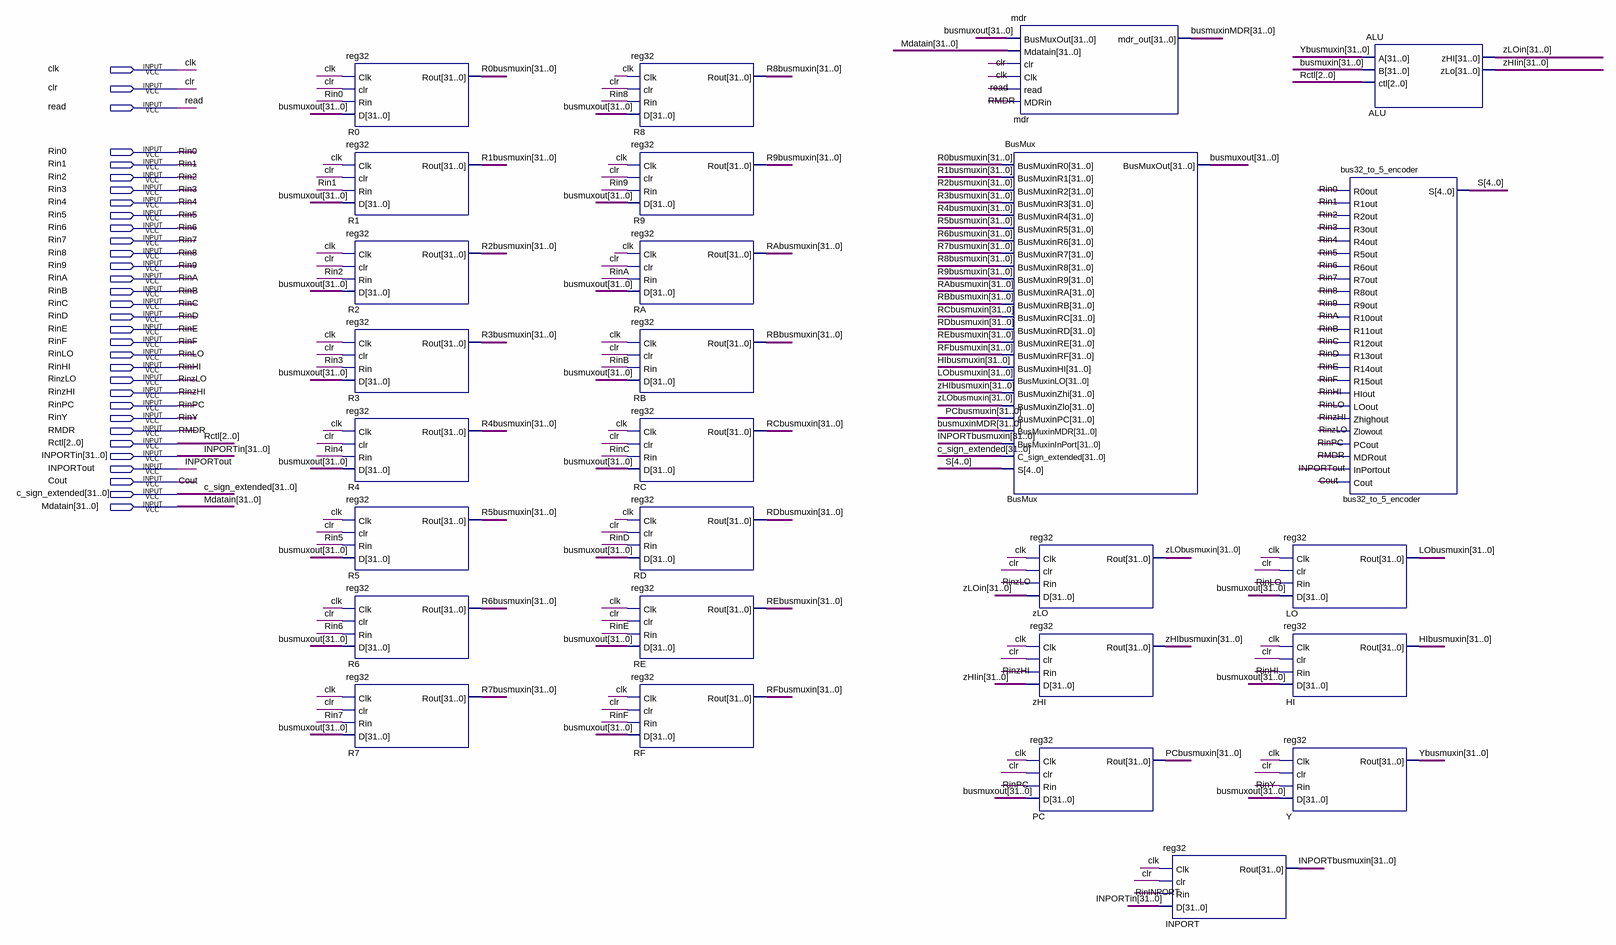
[diagram p0: schematic sheet]
// Quartus schematic Phase1.bdf as structural Verilog: 27 symbols, 32 pins
module Phase1 (
  input  clk,
  input  clr,
  input  read,
  input  Rin0,
  input  Rin1,
  input  Rin2,
  input  Rin3,
  input  Rin4,
  input  Rin5,
  input  Rin6,
  input  Rin7,
  input  Rin8,
  input  Rin9,
  input  RinA,
  input  RinB,
  input  RinC,
  input  RinD,
  input  RinE,
  input  RinF,
  input  RinLO,
  input  RinHI,
  input  RinzLO,
  input  RinzHI,
  input  RinPC,
  input  RinY,
  input  RMDR,
  input  [2:0] Rctl,
  input  [31:0] INPORTin,
  input  INPORTout,
  input  Cout,
  input  [31:0] c_sign_extended,
  input  [31:0] Mdatain
);

  wire RinINPORT;
  wire [4:0] S;
  wire [31:0] busmuxin, busmuxinMDR, busmuxout, HIbusmuxin, INPORTbusmuxin, LObusmuxin, PCbusmuxin,
       R0busmuxin, R1busmuxin, R2busmuxin, R3busmuxin, R4busmuxin, R5busmuxin, R6busmuxin, R7busmuxin,
       R8busmuxin, R9busmuxin, RAbusmuxin, RBbusmuxin, RCbusmuxin, RDbusmuxin, REbusmuxin, RFbusmuxin,
       Ybusmuxin, zHIbusmuxin, zHIin, zLObusmuxin, zLOin;

  reg32 R0 (.Clk(clk), .clr(clr), .Rin(Rin0), .D(busmuxout), .Rout(R0busmuxin));
  reg32 R1 (.Clk(clk), .clr(clr), .Rin(Rin1), .D(busmuxout), .Rout(R1busmuxin));
  reg32 R2 (.Clk(clk), .clr(clr), .Rin(Rin2), .D(busmuxout), .Rout(R2busmuxin));
  reg32 R3 (.Clk(clk), .clr(clr), .Rin(Rin3), .D(busmuxout), .Rout(R3busmuxin));
  reg32 R4 (.Clk(clk), .clr(clr), .Rin(Rin4), .D(busmuxout), .Rout(R4busmuxin));
  reg32 R5 (.Clk(clk), .clr(clr), .Rin(Rin5), .D(busmuxout), .Rout(R5busmuxin));
  reg32 R6 (.Clk(clk), .clr(clr), .Rin(Rin6), .D(busmuxout), .Rout(R6busmuxin));
  reg32 R7 (.Clk(clk), .clr(clr), .Rin(Rin7), .D(busmuxout), .Rout(R7busmuxin));
  reg32 R8 (.Clk(clk), .clr(clr), .Rin(Rin8), .D(busmuxout), .Rout(R8busmuxin));
  reg32 R9 (.Clk(clk), .clr(clr), .Rin(Rin9), .D(busmuxout), .Rout(R9busmuxin));
  reg32 RA (.Clk(clk), .clr(clr), .Rin(RinA), .D(busmuxout), .Rout(RAbusmuxin));
  reg32 RB (.Clk(clk), .clr(clr), .Rin(RinB), .D(busmuxout), .Rout(RBbusmuxin));
  reg32 RC (.Clk(clk), .clr(clr), .Rin(RinC), .D(busmuxout), .Rout(RCbusmuxin));
  reg32 RD (.Clk(clk), .clr(clr), .Rin(RinD), .D(busmuxout), .Rout(RDbusmuxin));
  reg32 RE (.Clk(clk), .clr(clr), .Rin(RinE), .D(busmuxout), .Rout(REbusmuxin));
  reg32 RF (.Clk(clk), .clr(clr), .Rin(RinF), .D(busmuxout), .Rout(RFbusmuxin));
  mdr mdr (
    .BusMuxOut(busmuxout), .Mdatain(Mdatain), .clr(clr), .Clk(clk), .read(read), .MDRin(RMDR),
    .mdr_out(busmuxinMDR));
  BusMux BusMux (
    .BusMuxinR0(R0busmuxin), .BusMuxinR1(R1busmuxin), .BusMuxinR2(R2busmuxin), .BusMuxinR3(R3busmuxin),
    .BusMuxinR4(R4busmuxin), .BusMuxinR5(R5busmuxin), .BusMuxinR6(R6busmuxin), .BusMuxinR7(R7busmuxin),
    .BusMuxinR8(R8busmuxin), .BusMuxinR9(R9busmuxin), .BusMuxinHI(HIbusmuxin), .BusMuxinLO(LObusmuxin),
    .BusMuxinZhi(zHIbusmuxin), .BusMuxinZlo(zLObusmuxin), .BusMuxinPC(PCbusmuxin), .BusMuxinMDR(busmuxinMDR),
    .BusMuxinInPort(INPORTbusmuxin), .C_sign_extended(c_sign_extended), .S(S), .BusMuxinRA(RAbusmuxin),
    .BusMuxinRB(RBbusmuxin), .BusMuxinRC(RCbusmuxin), .BusMuxinRD(RDbusmuxin), .BusMuxinRE(REbusmuxin),
    .BusMuxinRF(RFbusmuxin), .BusMuxOut(busmuxout));
  reg32 zLO (.Clk(clk), .clr(clr), .Rin(RinzLO), .D(zLOin), .Rout(zLObusmuxin));
  reg32 zHI (.Clk(clk), .clr(clr), .Rin(RinzHI), .D(zHIin), .Rout(zHIbusmuxin));
  reg32 PC (.Clk(clk), .clr(clr), .Rin(RinPC), .D(busmuxout), .Rout(PCbusmuxin));
  reg32 INPORT (.Clk(clk), .clr(clr), .Rin(RinINPORT), .D(INPORTin), .Rout(INPORTbusmuxin));
  reg32 LO (.Clk(clk), .clr(clr), .Rin(RinLO), .D(busmuxout), .Rout(LObusmuxin));
  reg32 HI (.Clk(clk), .clr(clr), .Rin(RinHI), .D(busmuxout), .Rout(HIbusmuxin));
  reg32 Y (.Clk(clk), .clr(clr), .Rin(RinY), .D(busmuxout), .Rout(Ybusmuxin));
  bus32_to_5_encoder bus32_to_5_encoder (
    .R0out(Rin0), .R1out(Rin1), .R2out(Rin2), .R3out(Rin3), .R4out(Rin4), .R5out(Rin5), .R6out(Rin6),
    .R7out(Rin7), .R8out(Rin8), .R9out(Rin9), .R10out(RinA), .R11out(RinB), .R12out(RinC), .R13out(RinD),
    .R14out(RinE), .R15out(RinF), .HIout(RinHI), .LOout(RinLO), .Zhighout(RinzHI), .Zlowout(RinzLO),
    .PCout(RinPC), .MDRout(RMDR), .InPortout(INPORTout), .Cout(Cout), .S(S));
  ALU ALU (.A(Ybusmuxin), .B(busmuxin), .ctl(Rctl), .zHI(zLOin), .zLo(zHIin));
endmodule
